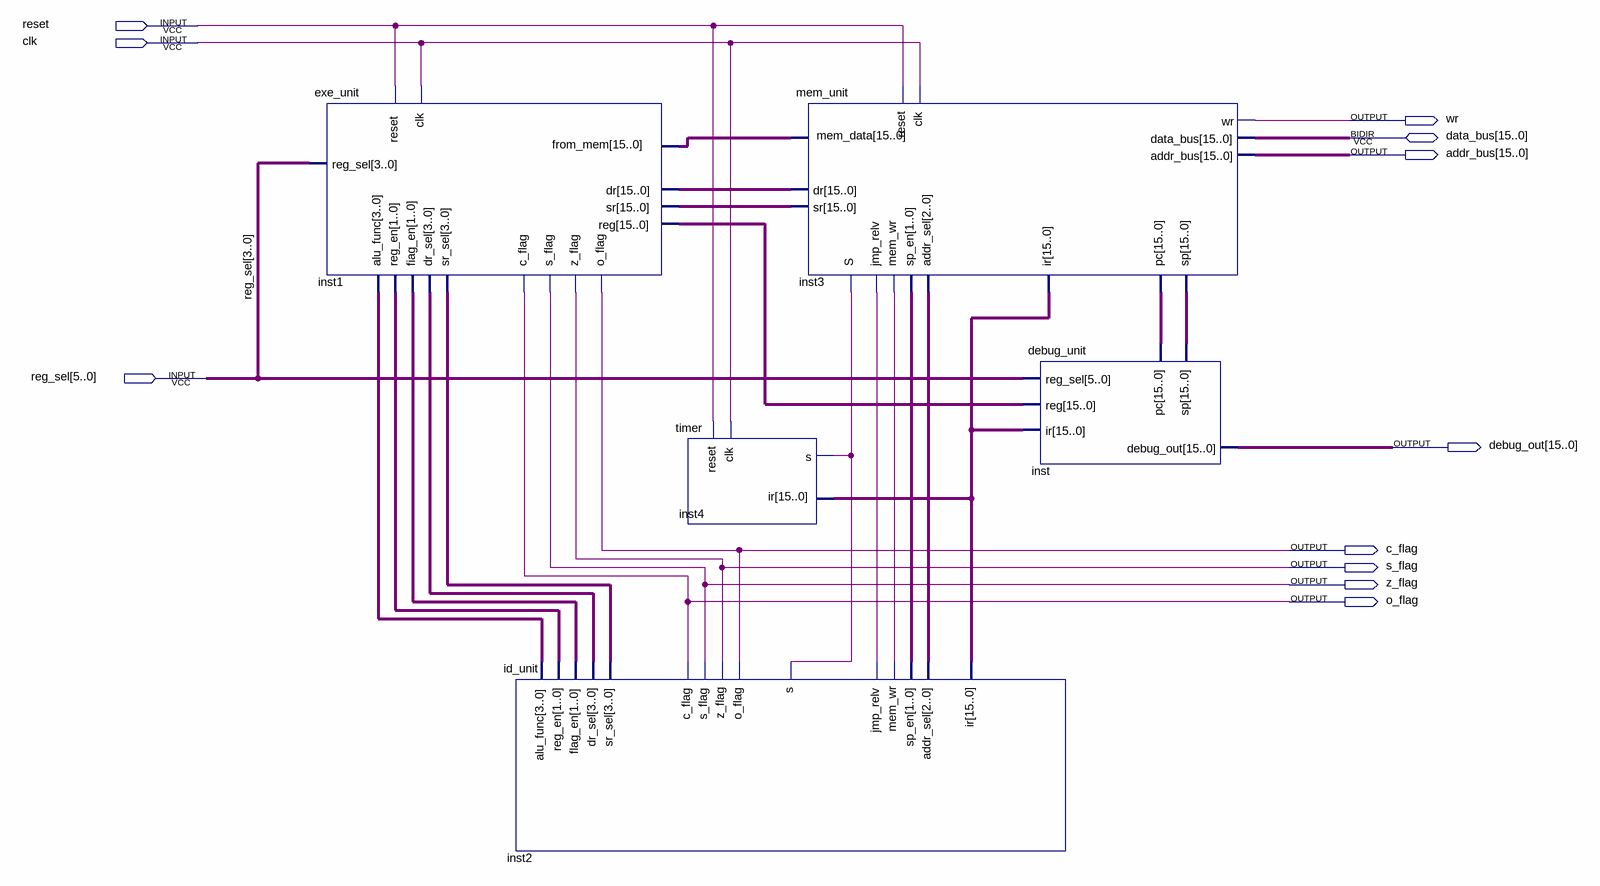
[diagram p0: schematic sheet]
// Quartus schematic cpu.bdf as structural Verilog: 5 symbols, 11 pins
module cpu (
  input  reset,
  input  clk,
  input  [5:0] reg_sel,
  inout  [15:0] data_bus,
  output wr,
  output [15:0] addr_bus,
  output [15:0] debug_out,
  output c_flag,
  output s_flag,
  output z_flag,
  output o_flag
);

  wire inst2_jmp_relv, inst2_mem_wr, inst4_s;
  wire [1:0] inst2_flag_en, inst2_reg_en, inst2_sp_en;
  wire [2:0] inst2_addr_sel;
  wire [3:0] inst2_alu_func, inst2_dr_sel, inst2_sr_sel;
  wire [15:0] inst1_dr, inst1_reg, inst1_sr, inst3_ir, inst3_mem_data, inst3_pc, inst3_sp;

  exe_unit inst1 (
    .reset(reset), .clk(clk), .fiag_en(inst2_flag_en), .alu_func(inst2_alu_func), .reg_en(inst2_reg_en),
    .dr_sel(inst2_dr_sel), .sr_sel(inst2_sr_sel), .reg_sel(reg_sel[3:0]), .from_mem(inst3_mem_data),
    .c_flag(o_flag), .s_flag(z_flag), .z_flag(s_flag), .o_flag(c_flag), .dr(inst1_dr), .sr(inst1_sr),
    .\reg (inst1_reg));
  id_unit inst2 (
    .s(inst4_s), .c_flag(o_flag), .s_flag(z_flag), .z_flag(s_flag), .o_flag(c_flag), .ir(inst3_ir),
    .mem_wr(inst2_mem_wr), .jmp_relv(inst2_jmp_relv), .reg_en(inst2_reg_en), .flag_en(inst2_flag_en),
    .addr_sel(inst2_addr_sel), .sp_en(inst2_sp_en), .dr_sel(inst2_dr_sel), .sr_sel(inst2_sr_sel),
    .alu_func(inst2_alu_func));
  timer inst4 (.reset(reset), .clk(clk), .ir(inst3_ir), .s(inst4_s));
  mem_unit inst3 (
    .reset(reset), .clk(clk), .S(inst4_s), .mem_wr(inst2_mem_wr), .dr(inst1_dr), .sr(inst1_sr),
    .addr_sel(inst2_addr_sel), .sp_en(inst2_sp_en), .jmp_relv(inst2_jmp_relv), .wr(wr), .addr_bus(addr_bus),
    .mem_data(inst3_mem_data), .pc(inst3_pc), .sp(inst3_sp), .ir(inst3_ir), .data_bus(data_bus));
  debug_unit inst (
    .reg_sel(reg_sel), .\reg (inst1_reg), .ir(inst3_ir), .pc(inst3_pc), .sp(inst3_sp), .debug_out(debug_out));
endmodule
